# Altium schematic sheet Microcontroller.SchDoc
size A4; SheetNumber: 6; SheetTotal: 11
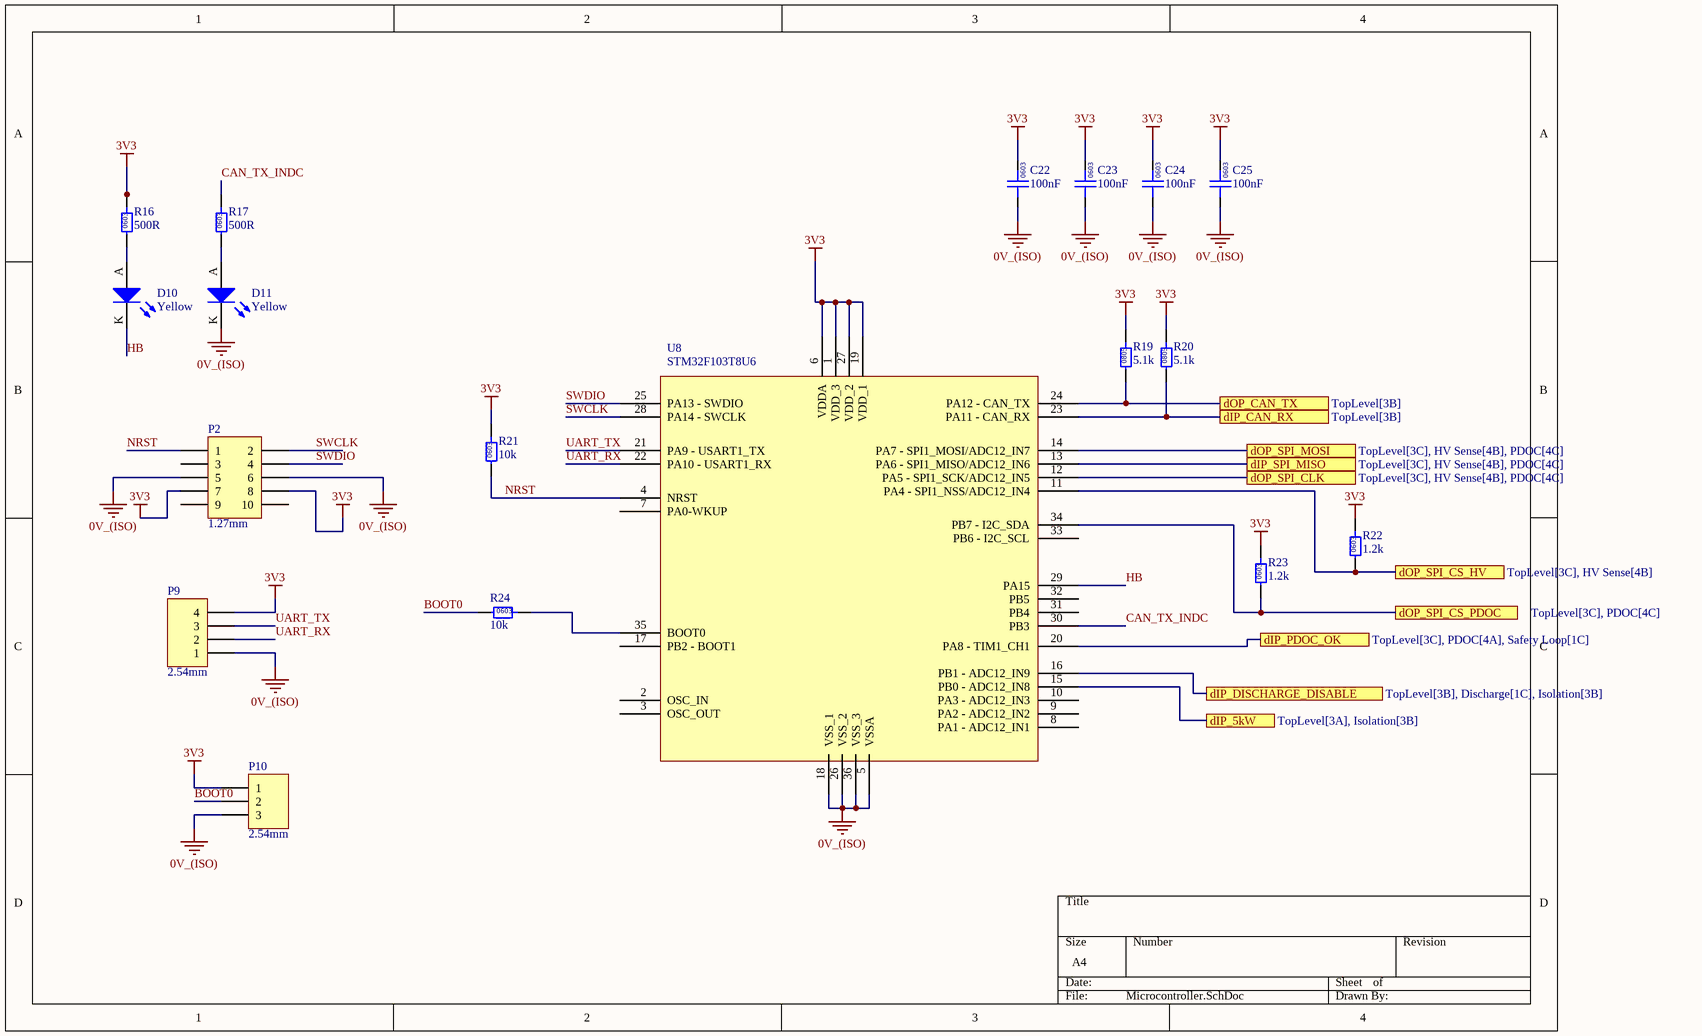
[diagram p0: Microcontroller.SchDoc]

## Parts
C22  100nF  [0603]
C23  100nF  [0603]
C24  100nF  [0603]
C25  100nF  [0603]
D10  Yellow  [0805 LED]
D11  Yellow  [0805 LED]
P2  1.27mm  [3221-10-0300-00]
P9  2.54mm  [TH 2.54mm Header 1x4]
P10  2.54mm  [TH 2.54mm Header 1x3]
R16  500R  [0603]
R17  500R  [0603]
R19  5.1k  [0805]
R20  5.1k  [0805]
R21  10k  [0603]
R22  1.2k  [0603]
R23  1.2k  [0603]
R24  10k  [0603]
U8  STM32F103T8U6  [STM_QFN-36]

## Ports
dIP_5kW (see TopLevel[3A], Isolation[3B]), dIP_CAN_RX (see TopLevel[3B]), dIP_DISCHARGE_DISABLE (see TopLevel[3B], Discharge[1C], Isolation[3B]), dIP_PDOC_OK (see TopLevel[3C], PDOC[4A], Safety Loop[1C]), dIP_SPI_MISO (see TopLevel[3C], HV Sense[4B], PDOC[4C]), dOP_CAN_TX (see TopLevel[3B]), dOP_SPI_CLK (see TopLevel[3C], HV Sense[4B], PDOC[4C]), dOP_SPI_CS_HV (see TopLevel[3C], HV Sense[4B]), dOP_SPI_CS_PDOC (see TopLevel[3C], PDOC[4C]), dOP_SPI_MOSI (see TopLevel[3C], HV Sense[4B], PDOC[4C])

## Nets
0V_(ISO): C22.1 C23.1 C24.1 C25.1 D11.K P2.5 P2.6 P9.1 P10.3 U8.5(VSSA) U8.18(VSS_1) U8.26(VSS_2) U8.36(VSS_3)
3V3: C22.2 C23.2 C24.2 C25.2 P2.7 P2.8 P9.4 P10.1 R16.2 R19.2 R20.2 R21.2 R22.2 R23.2 U8.1(VDD_3) U8.6(VDDA) U8.19(VDD_1) U8.27(VDD_2)
BOOT0: P10.2 R24.1
CAN_TX_INDC: R17.2 U8.30(PB3)
dIP_5kW: U8.15(PB0_-_ADC12_IN8) ; port dIP_5kW
dIP_CAN_RX: R20.1 U8.23(PA11_-_CAN_RX) ; port dIP_CAN_RX
dIP_DISCHARGE_DISABLE: U8.16(PB1_-_ADC12_IN9) ; port dIP_DISCHARGE_DISABLE
dIP_PDOC_OK: U8.20(PA8_-_TIM1_CH1) ; port dIP_PDOC_OK
dIP_SPI_MISO: U8.13(PA6_-_SPI1_MISO/ADC12_IN6) ; port dIP_SPI_MISO
dOP_CAN_TX: R19.1 U8.24(PA12_-_CAN_TX) ; port dOP_CAN_TX
dOP_SPI_CLK: U8.12(PA5_-_SPI1_SCK/ADC12_IN5) ; port dOP_SPI_CLK
dOP_SPI_CS_HV: R22.1 U8.11(PA4_-_SPI1_NSS/ADC12_IN4) ; port dOP_SPI_CS_HV
dOP_SPI_CS_PDOC: R23.1 U8.34(PB7_-_I2C_SDA) ; port dOP_SPI_CS_PDOC
dOP_SPI_MOSI: U8.14(PA7_-_SPI1_MOSI/ADC12_IN7) ; port dOP_SPI_MOSI
HB: D10.K U8.29(PA15)
NRST: P2.1 R21.1 U8.4(NRST)
SWCLK: P2.2 U8.28(PA14_-_SWCLK)
SWDIO: P2.4 U8.25(PA13_-_SWDIO)
UART_RX: P9.2 U8.22(PA10_-_USART1_RX)
UART_TX: P9.3 U8.21(PA9_-_USART1_TX)
NetD10_A: D10.A R16.1
NetD11_A: D11.A R17.1
NetR24_2: R24.2 U8.35(BOOT0)

Not connected (* = marked no-connect by the designer): P2 3 9 10; U8 2(OSC_IN) 3(OSC_OUT) 7(PA0-WKUP) 8(PA1_-_ADC12_IN1) 9(PA2_-_ADC12_IN2) 10(PA3_-_ADC12_IN3) 17(PB2_-_BOOT1_) 31(PB4) 32(PB5) 33(PB6_-_I2C_SCL)

## Notes on the sheet
- (in symbol GCM188L81H104KA57D) 0603
- (in symbol RC0603FR-0710KL) 0603
- (in symbol RC0603JR-071K2L) 0603
- (in symbol RC0805FR075K1L) 0805
- (in symbol RT0603BRD07500RL) 0603

## Library data of the parts
C22-C25 = GCM188L81H104KA57D: Manufacturer: muRata; Rated Voltage: 50V; Tolerance: ±10%; Material: MLCC; Temperature Rating: X8L; Part Number: GCM188L81H104KA57D; Value: 100nF; Digikey Part Number: 490-6049-1-ND
D10 D11 = SML-211YTT86: Yellow LED Indication - Discrete 1.75V 0805 (2012 Metric); Manufacturer: ROHM Semiconductor; Part Number: SML-211YTT86; Colour: Yellow; Digikey Part Number: 511-1293-1-ND
P2 = SMD 1.27mm Header 2x5 (3221-10-0300-00): Positions: 10; Angle: 0; Flange: No; Contact: NA; Part Number: SMD 1.27mm Header 2x5 (3221-10-0300-00); Pitch: 1.27mm; Row Spacing: 1.27mm
P9 = TH 2.54mm Header 1x4: Positions: 4; Angle: 0; Flange: No; Contact: NA; Part Number: TH 2.54mm Header 1x4; Pitch: 2.54mm; Row Spacing: 2.54mm
P10 = TH 2.54mm Header 1x3: Positions: 3; Angle: 0; Flange: No; Contact: NA; Part Number: TH 2.54mm Header 1x3; Pitch: 2.54mm; Row Spacing: 2.54mm
R16 R17 = RT0603BRD07500RL: Manufacturer: YAGEO; Tolerance: 0.01; Rated Power: 0.1W; Part Number: RT0603BRD07500RL; Value: 500R; Material: FR-07; Digikey Part Number: 13-RT0603BRD07500RL-ND
R19 R20 = RC0805FR075K1L: Manufacturer: YAGEO; Tolerance: 0.01; Rated Power: 0.125W; Part Number: RC0805FR075K1L; Value: 5.1k; Material: FR-07; Digikey Part Number: 311-5.10KCRCT-ND
R21 R24 = RC0603FR-0710KL: Manufacturer: YAGEO; Tolerance: 0.01; Rated Power: 0.1W; Part Number: RC0603FR-0710KL; Value: 10k; Digikey Part Number: 311-10.0KHRCT-ND; Material: FR-07
R22 R23 = RC0603JR-071K2L: Manufacturer: YAGEO; Tolerance: 0.01; Rated Power: 0.1W; Part Number: RC0603JR-071K2L; Value: 1.2k; Material: FR-07; Digikey Part Number: 311-1.2KGRCT-ND
U8 = STM32F103T8U6: ARM® Cortex®-M3 STM32F1 Microcontroller IC 32-Bit 72MHz 64KB (64K x 8) FLASH QFN; Manufacturer: ST Microelectronics; Part Number: STM32F103T8U6; Digikey Part Number: STM32F103T8U6; Digikey Link: https://www.digikey.com/en/products/detail/stmicroelectronics/stm32f103t8u6/1852493